# EAGLE design spi_eeprom (EAGLE 6.2)
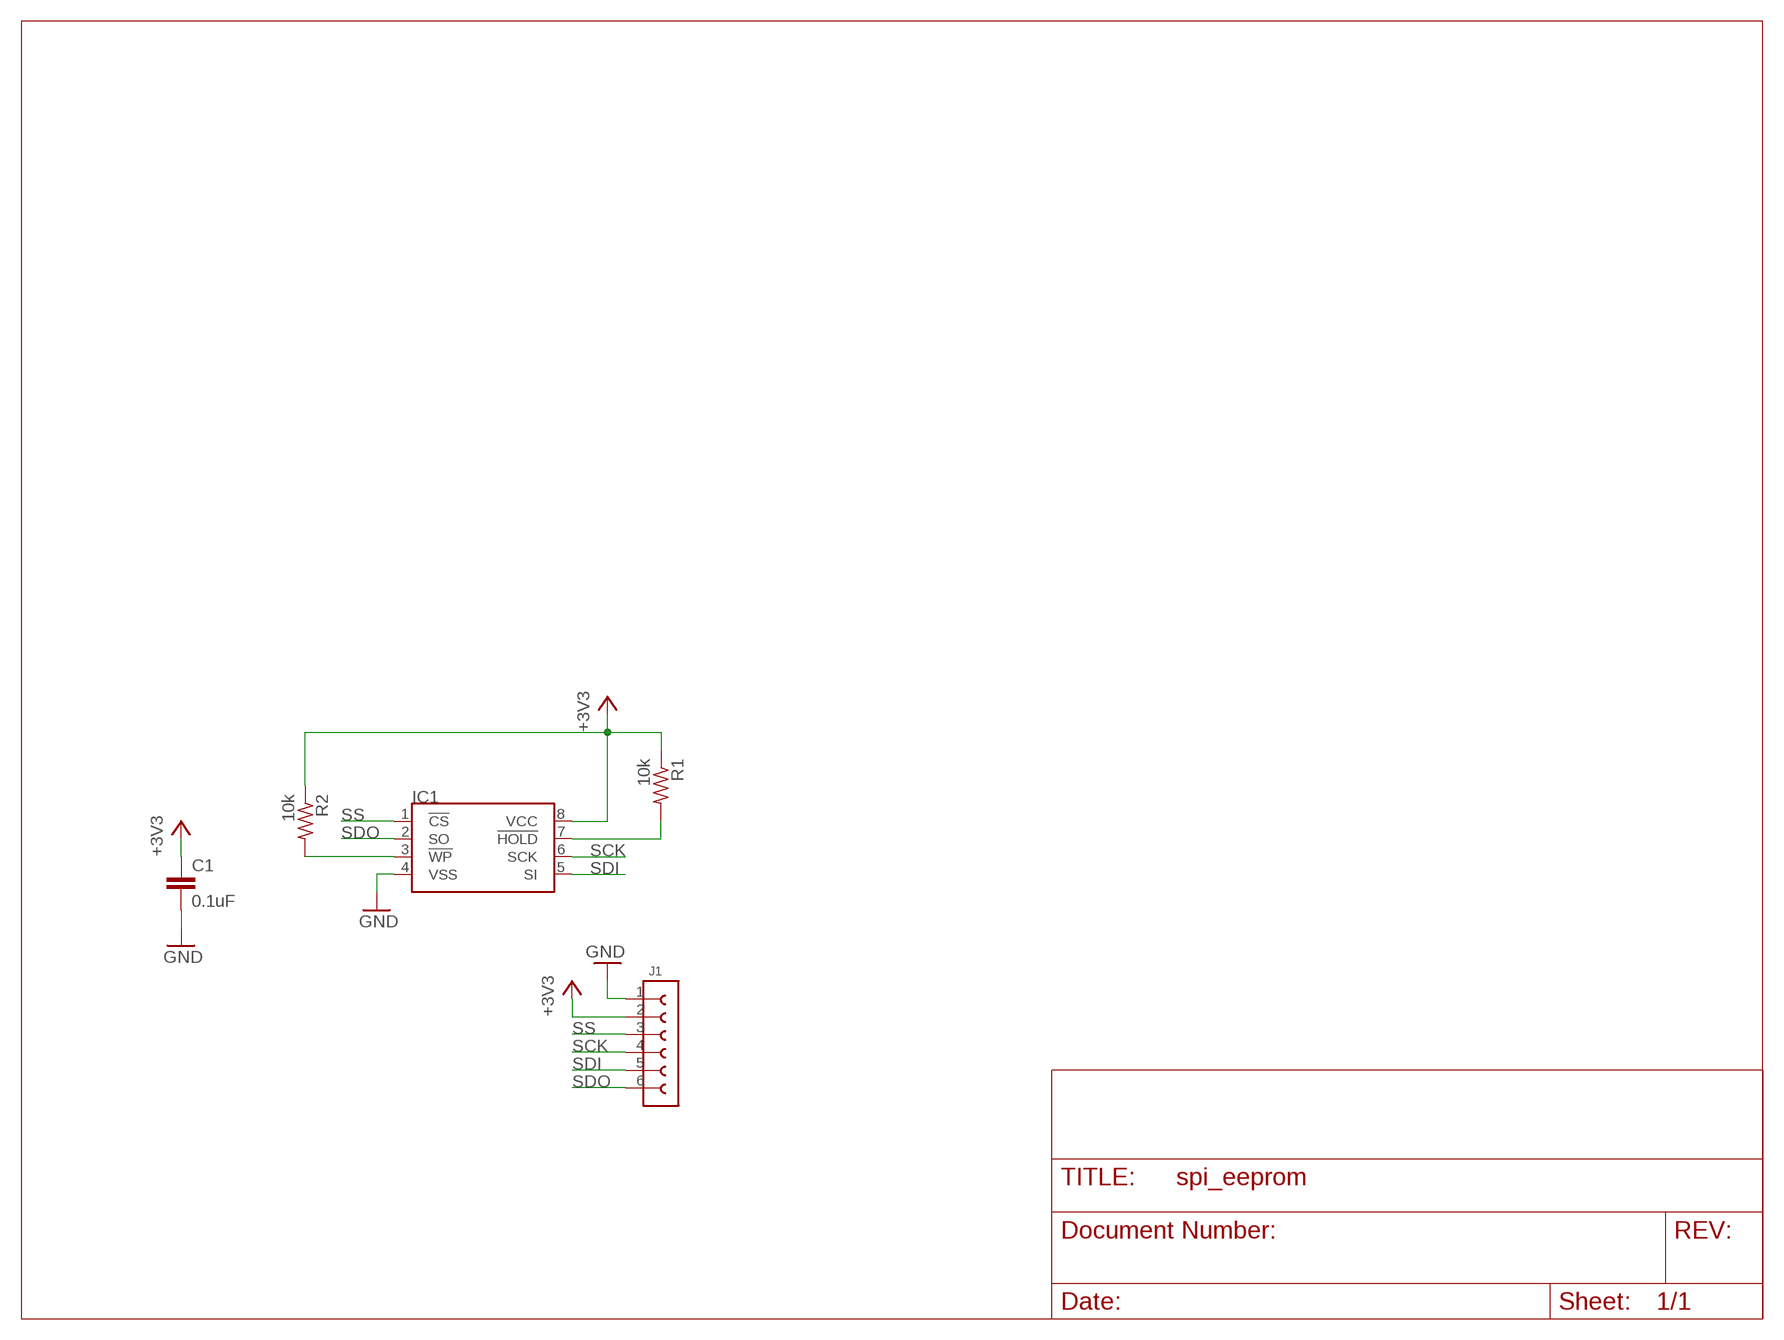
[diagram p0: schematic, sheet 1]

## Parts
C1  0.1uF  C0603C104Z3VAC  [CAPC0603]
IC1  25LC320A-I/SN  [SOIC127P600X175-8N]
J1  61300611121  [PHSP254P1524X254X1154-6S]
R1  10k  CRG0603F10K10  [RESC0603]
R2  10k  CRG0603F10K10  [RESC0603]

## Nets
+3V3: C1.1 IC1.8(VCC) J1.2 R1.P$1 R2.P$1
GND: C1.2 IC1.4(VSS) J1.1
N$7: IC1.3(!WP) R2.P$2
N$8: IC1.7(!HOLD) R1.P$2
SCK: IC1.6(SCK) J1.4
SDI: IC1.5(SI) J1.5
SDO: IC1.2(SO) J1.6
SS: IC1.1(!CS) J1.3

## Library data of the parts
C1 = kemet-capacitors-ceramic:C?C*VAC: Y5V Dielectric, 6.3 – 50 VDC (Commercial Grade) Description OVERVIEW: KEMET’s Y5V dielectric features an 85°C maximum operating temperature and is considered “general-purpose.” The Electronics Components, Assemblies & Materials Association (EIA) characterizes Z5U dielectric as a Class III material. Components of this classiﬁ cation are ﬁ xed, ceramic dielectric capacitors suited for bypass and decoupling or other applications in which dielectric losses, high insulation resistance and capacitance stability are not of major importance. Y5V exhibits a predictable change in capacitance with respect to time and voltage and displays wide variations in capacitance with reference to ambient temperature. Capacitance change is limited to +22%, -82% from -30°C to +85°C. APPLICATIONS: Typical applications include limited temperature, decoupling and bypass. BENEFITS • -30°C to +85°C operating temperature range • Pb-Free and RoHS Compliant • EIA 0402, 0603, 0805, 1206, and 1210 case sizes • DC voltage ratings of 6.3 V, 10 V, 16 V, 25 V, and 50 V • Capacitance offerings ranging from 0.022 μF to 22 μF • Available capacitance tolerance of +80%/ -20% • Non-polar device, minimizing installation concerns • 100% pure matte tin-plated termination ﬁ nish that allowing for excellent solderability How to Order C 1210 C 226 Z 4 V A C TU Capacitor Class Case Size Specification Series Capacitance Code (pF) Capacitance Tolerance Voltage Dielectric Failure Rate/Design Termination Finish Packaging Grade C = Ceramic 0402 0603 0805 1206 1210 C = Standart 2 signiﬁ cant digits + number of zeros. Use 9 for 1.0 – 9.9 pF Use 8 for 0.5 – .99 pF e.g., 2.2 pF = 229 e.g., 0.5 pF = 508 Z = +80%/-20% 9 = 6.3V 8 = 10V 4 = 16V 3 = 25V 5 = 50 V V = Y5V A = N/A A = 100% Matte Blank = Bulk TU = 7" Reel Unmarked. Ref: Datasheet <http://www.kemet.com/kemet/web/homepage/kechome.nsf/weben/B79D94FAACCDEFCE852579F10063745E/$file/KEM_CC101_COMM_SMD.pdf> Add more variants to C@VAC, just remplace the "@" with a new technologie named according to order code parameters. It is mandatory to fill up the following attributes MANUFACTURER, DESCRIPTION, MOUSER, AVNET, ARROW, FUTURE, NEWARK, DIGIKEY, AVRG-PRICE, OCTOPART-LINK, DATASHEET; AVNET: C0603C104Z3VAC TU; AVRG-PRICE: 0.1; DATASHEET: http://www.kemet.com/kemet/web/homepage/kechome.nsf/weben/B79D94FAACCDEFCE852579F10063745E/$file/KEM_CC101_COMM_SMD.pdf; DESCRIPTION: Capacitores cerámicos de capas múltiples (MLCC) - SMD/SMT0603 25volts 0.1uF Y5V -20+80%; DIGIKEY: 399-1100-2-ND; EAGLEUP: CAPC0603; MANUFACTURER: KEMET; MOUSER: 80-C0603C104Z3V; NEWARK: 31C9013; OCTOPART-LINK: http://octopart.com/c0603c104z3vactu-kemet-98662
IC1 = mchp-memories:25*320A-I/?: 32K SPI Bus Serial EEPROM Description The Microchip Technology Inc. 25AA320A/25LC320A (25XX320A*) are 32 kbit Serial Electrically Erasable PROMs. The memory is accessed via a simple Serial Peripheral Interface (SPI) compatible serial bus. The bus signals required are a clock input (SCK) plus separate data in (SI) and data out (SO) lines. Access to the device is controlled through a Chip Select (CS) input. Communication to the device can be paused via the hold pin (HOLD). While the device is paused, transitions on its inputs will be ignored, with the exception of Chip Select, allowing the host to service higher priority interrupts. The 25XX320A is available in standard packages including 8-lead PDIP and SOIC, and advanced packaging including 8-lead MSOP, TSSOP and 2x3 TDFN. FEATURES Max. Clock 10 MHz Low-Power CMOS Technology - Max. Write Current: 5 mA at 5.5V, 10 MHz - Read Current: 5 mA at 5.5V, 10 MHz- Standby Current: 5 µA at 5.5V 4096 x 8-bit Organization 32-Byte Page Self-Timed Erase and Write Cycles (5 ms max.) Block Write Protection- Protect none, 1/4, 1/2 or all of array Built-in Write Protection- Power-on/off data protection circuitry- Write enable latch- Write-protect pin Sequential Read High Reliability- Endurance: >1M erase/write cycles- Data retention: > 200 years- ESD protection: > 4000V How to order Family Voltage Density Temp Package 25 = eeprom AA = 1.8-5.5v LC = 2.5-5.5v 230A = 32Kbits Industrial (I): -40°C to +85°C Automotive (E): -40°C to +125°C P = PDIP SN = SOIC ST = TSSOP MS = MSOP MNY = TDFN Ref: Datasheet <http://ww1.microchip.com/downloads/en/DeviceDoc/21828F.pdf>; AVRG-PRICE: 0.75; DATASHEET: http://ww1.microchip.com/downloads/en/DeviceDoc/21828F.pdf; DESCRIPTION: 32K BIT SPI SEEPROM 2.5V; DIGIKEY: 25LC320A-I/SN-ND; EAGLEUP: SOIC127P600X175-8N; MOUSER: 579-25LC320A-I/SN; NEWARK: 31K5833; OCTOPART-LINK: http://octopart.com/25lc320a-i%2Fsn-microchip-843316
J1 = wurth-pin-socket-headers:6130061?: (6) 2.54mm Pin Header Description MATERIAL INSULATOR: PBT FLAMABILITY RATING: UL94-V0 COLOR: BLACK CONTACT MATERIAL: COPPER ALLOY CONTACT TYPE: STAMPED CONTACT PLATING: GOLD QUALITY CLASS: 3 AS PER CECC 75 301-802 PITCH: 2.54MM ENVIRONMENTAL OPERATING TEMPERATURE: -40 UP TO 125°C COMPLIANCE: LEAD FREE AND ROHS ELECTRICAL CURRENT RATING: 3A WORKING VOLTAGE: 250V AC INSULATOR RESISTANCE: >1000 MOHM DIELECTRIC WITHSTANDING VOLTAGE: 500V AC/MN CONTACT RESISTANCE: 20 mOHM MAX DIMENSION B = 2.54 x NB POSITIONS How to order Type Header/Socket Number of Positions Variation 613 = 2.54mm Pitch from 1 to 40 1121 = Pin Header Straigh Post 1021 = Pin Header Right Angle 1821 = Socket Header Straigh Post 43121 = Socket Header Right Angle Ref: Datasheet <http://katalog.we-online.de/em/datasheet/6130xx11121.pdf> , Datasheet <http://katalog.we-online.de/em/datasheet/6130xx11021.pdf> , Datasheet <http://katalog.we-online.de/em/datasheet/6130xx11821.pdf> , Datasheet <http://katalog.we-online.de/em/datasheet/6130xx143121.pdf>; AVRG-PRICE: 0.41; DATASHEET: http://www.mouser.com/ds/2/445/6130xx11121-48870.pdf; DESCRIPTION: pin header straight post 2.54"; EAGLEUP: PHSP254P1524X254X1154-6S; MANUFACTURER: WURTH; MOUSER: 710-61300611121; OCTOPART-LINK: http://octopart.com/61300611121-w%C3%BCrth+elektronik+midcom-20084590
R1 R2 = te-fixed-resistors:CRG?*: Thick Film Chip Resistors 1% and 5% tolerance Description Precious metal terminations are screen printed onto a ceramic base and fired. The resistive element is screen printed and fired and the passivation layer added. Each resistor is trimmed to tolerance by laser. The pre-scribed tile is broken into strips, the end plating is fired on and the strips broken into individual components. Final termination is made by electroplating. Key Features Thick film resistors with a high power to size ratio,ideally suited to industrial and general purpose use. A range from 1 ohm to 10M and tolerances of 1% and 5%. Also including zero ohm links. Suitable for most applications, including high frequency operation, owing to the short lead structure and low capacitance. Seven Package Sizes Terminal finish: Matte Sn MSL Level 2 How to order Common Part Size Tolerance Resistance Value CRG - Thick Film Chip Resistor 0201 0402 0603 0805 1206 2512 F - ±1% J - ±5% 1 ohm (1 ohm) 1R0 1K ohm (1000 ohms) 1K 100K ohm (100000 ohms) 100K 1M ohm (1000000 ohms) 1M Ref: Datasheet <http://www.te.com/commerce/DocumentDelivery/DDEController?Action=showdoc&DocId=Data+Sheet%7F1773204%7FH%7Fpdf%7FEnglish%7FENG_DS_1773204_H.pdf%7F1623095-1>; AVRG-PRICE: 0.1; DATASHEET: http://www.te.com/commerce/DocumentDelivery/DDEController?Action=showdoc&DocId=Data+Sheet%7F1773204%7FH%7Fpdf%7FEnglish%7FENG_DS_1773204_H.pdf%7F1623095-1; DESCRIPTION: Resistores de película gruesa - SMD CRG0603 1% 10K 10KRL; EAGLEUP: RESC0603; MOUSER: 279-CRG0603F10K/10; OCTOPART-LINK: http://octopart.com/crg0603f10k10-tyco+electronics-16077289

## Board
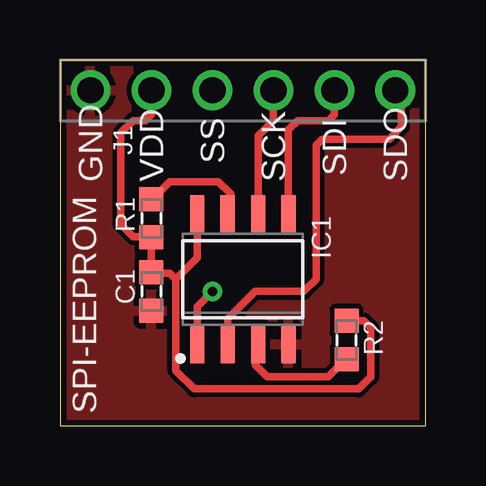
[diagram p1: board, top side]
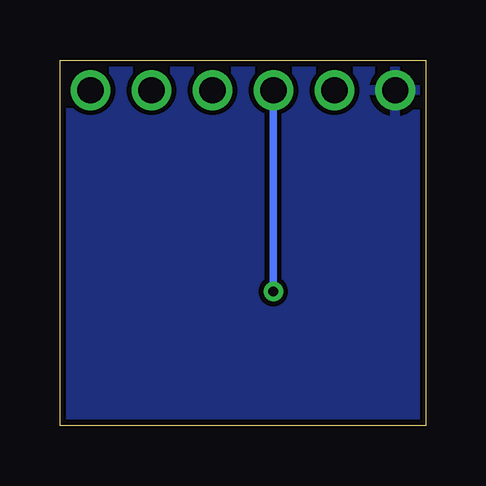
[diagram p2: board, bottom side, seen from below]

Size 15.24 x 15.23 mm. Coordinates in mm from the lower left corner, seen from the top.
Outline: 0,0 15.24,0 15.24,15.23 0,15.23 0,0
Copper layers (1*16): Top 0.035mm / dielectric 1.5mm / Bottom 0.035mm
Design rules: minimum track width 10mil, minimum drill 12mil, track to track 8mil, track to pad 8mil, pad to pad 8mil, via to via 8mil, smd to smd 8mil, copper to edge 10mil, drill to drill 8mil, minimum pad ring 10mil, minimum via ring 8mil, stop-mask expansion 4mil, vias tented up to drill 0mil, thermal gap 10mil

### Footprints (pad centres in the part's own frame; a part is rotated, then mirrored left to right if it is on the bottom)
CAPC0603 = smd 1 x 1: 1 0.8,0; 2 -0.8,0
SOIC127P600X175-8N = smd 1.6 x 0.6: 1 -2.7,1.9; 2 -2.7,0.63; 3 -2.7,-0.64; 4 -2.7,-1.9; 5 2.7,-1.9; 6 2.7,-0.64; 7 2.7,0.64; 8 2.7,1.9
PHSP254P1524X254X1154-6S = drill 1.1: 1 0,0; 2 2.54,0; 3 5.08,0; 4 7.62,0; 5 10.16,0; 6 12.7,0
RESC0603 = smd 1 x 1: P$1 0.8,0; P$2 -0.8,0

### Placement (x,y rotation side)
C1  3.81,5.59 90 top
IC1  7.62,6.1 90 top
J1  1.27,13.97 0 top
R1  3.81,8.64 270 top
R2  11.94,3.56 90 top

### Tracks (layer width: path | path; a pad name or v marks a point on that pad's centre or on a via)
+3V3
  Top 0.305: J1.2 3.81,12.95 3.56,12.7 3.05,12.7 2.54,12.19 2.54,8.38 3.05,7.87 3.77,7.87 R1.P$1 C1.1 3.85,6.35 4.57,6.35 4.83,6.1 | R2.P$1 12.66,4.36 12.95,4.06 12.95,2.03 12.45,1.52 5.59,1.52 4.83,2.29 4.83,6.1 | IC1.8 5.72,6.99 4.83,6.1
GND
  pour Bottom: 0,15.24 15.24,15.24 15.24,0 0,0
  pour Top: 0,15.24 15.24,15.24 15.24,0 0,0
N$7
  Top 0.305: R2.P$2 11.9,2.76 11.18,2.03 8.64,2.03 8.13,2.54 8.13,3.26 IC1.3
N$8
  Top 0.305: R1.P$2 3.85,9.44 4.57,10.16 6.6,10.16 7.11,9.65 7.11,8.93 IC1.7
SCK
  Top 0.305: IC1.6 8.26,12.07 8.89,12.7 J1.4
SDI
  Top 0.305: IC1.5 9.52,12.31 9.91,12.7 11.18,12.7 11.43,12.95 J1.5
SDO
  Top 0.305: IC1.2 6.99,4.45 8.13,5.59 10.16,5.59 10.67,6.1 10.67,11.68 10.92,11.94 13.72,11.94 14.22,12.45 14.22,13.72 J1.6
SS  (via drill 0.41)
  Top 0.305: IC1.1 5.72,4.96 v6.35,5.59
  Bottom 0.305: v6.35,5.59 J1.3

### Text on the board
tPlace: SS | GND | VDD | SCK | SDI | SDO | SPI-EEPROM